# Altium schematic sheet dctodcisole.SchDoc
size A; SheetNumber: 1; SheetTotal: 1
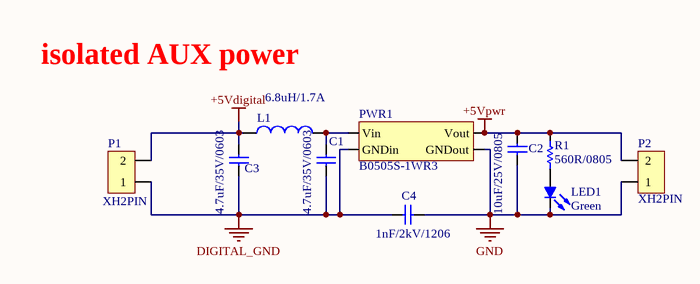
[diagram p0: dctodcisole.SchDoc]

## Parts
C1  4.7uF/35V/0603  [cap 0603]
C2  10uF/25V/0805  [CAP 0805]
C3  4.7uF/35V/0603  [cap 0603]
C4  1nF/2kV/1206  [CAP 1206]
L1  6.8uH/1.7A  [1008(2520 metric)]
LED1  COLOR: Green  [LED 3mm]  (hidden comment: LED 3mm/Green)
P1  XH2PIN  [pin-header 2*1]
P2  XH2PIN  [pin-header 2*1]
PWR1  B0505S-1WR3  [B0505S]
R1  560R/0805  [RES 0805]

## Nets
+5Vdigital: C3.1(+) L1.1 P1.2
+5Vpwr: C2.1(+) P2.2 PWR1.4(Vout) R1.2
DIGITAL_GND: C1.2(-) C3.2(-) C4.1(+) P1.1 PWR1.1(GNDin)
GND: C2.2(-) C4.2(-) LED1.2(K) P2.1 PWR1.3(GNDout)
NetC1_1: C1.1(+) L1.2 PWR1.2(Vin)
NetLED1_1: LED1.1(A) R1.1

## Notes on the sheet
- isolated AUX power

## Library data of the parts
C1-C4 = Capacitor
L1 = Inductor
LED1 = LED: Typical LED
P1 P2 = Header 2H: RELAY; LatestRevisionDate: 17-Jul-2002; LatestRevisionNote: Re-released for DXP Platform.; Publisher: Altium Limited
R1 = Res: value: 560R/0805